# Altium schematic sheet Buck_Boost_Converter_B.SchDoc
size A4; SheetNumber: 8; SheetTotal: 10
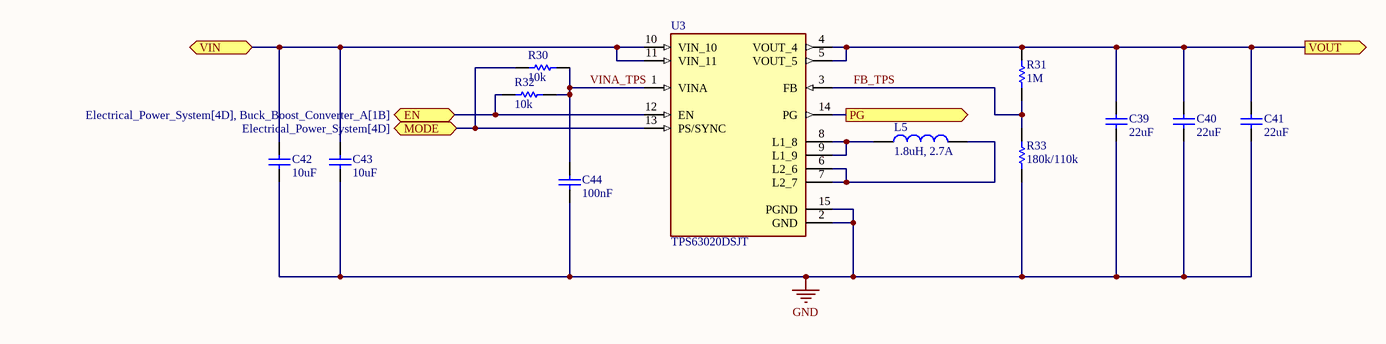
[diagram p0: Buck_Boost_Converter_B.SchDoc]

## Parts
C39  value 22uF  [CAP-SM-0603]  (hidden comment: Cap Non-Pol SMD)
C40  value 22uF  [CAP-SM-0603]  (hidden comment: Cap Non-Pol SMD)
C41  value 22uF  [CAP-SM-0603]  (hidden comment: Cap Non-Pol SMD)
C42  value 10uF  [CAP-SM-0603]  (hidden comment: Cap Non-Pol SMD)
C43  value 10uF  [CAP-SM-0603]  (hidden comment: Cap Non-Pol SMD)
C44  value 100nF  [CAP-SM-0603]  (hidden comment: Cap Non-Pol SMD)
L5  1.8uH, 2.7A  [WE-PD2A_4532]
R30  value 10k  [RES-SM-0603]  (hidden comment: RESISTOR SMD)
R31  value 1M  [RES-SM-0603]  (hidden comment: RESISTOR SMD)
R32  value 10k  [RES-SM-0603]  (hidden comment: RESISTOR SMD)
R33  value 180k/110k  [RES-SM-0603]  (hidden comment: RESISTOR SMD)
U3  TPS63020DSJT  [IC_TPS63020DSJT]

## Ports
EN (bidir, see Electrical_Power_System[4D], Buck_Boost_Converter_A[1B]), MODE (bidir, see Electrical_Power_System[4D]), PG (out, see Electrical_Power_System[4D]), VIN (bidir, see Electrical_Power_System[4D], Buck_Boost_Converter_A[1B]), VOUT (out, see Electrical_Power_System[3D])

## Nets
GND: C39.1 C40.1 C41.1 C42.1 C43.1 C44.1 R33.1 U3.2(GND) U3.15(PGND)
EN: R32.2 U3.12(EN) ; port EN
FB_TPS: R31.1 R33.2 U3.3(FB)
MODE: R30.2 U3.13(PS/SYNC) ; port MODE
PG: U3.14(PG) ; port PG
VIN: C42.2 C43.2 U3.10(VIN_10) U3.11(VIN_11) ; port VIN
VINA_TPS: C44.2 R30.1 R32.1 U3.1(VINA)
VOUT: C39.2 C40.2 C41.2 R31.2 U3.4(VOUT_4) U3.5(VOUT_5) ; port VOUT
NetL5_1: L5.1 U3.8(L1_8) U3.9(L1_9)
NetL5_2: L5.2 U3.6(L2_6) U3.7(L2_7)

## Library data of the parts
C39-C44 = Cap Non-Pol SMD: Capacitor
L5 = 784773018: WE-PD2A SMT Power Inductor, size 4532, 1.8uH, 2.7A; Manufacturer: Wurth Elektronik; DC Resistance max.: 0.064Ohm; Saturation Current: 3.6A; Self Resonant Frequency: 85MHz; DC Resistance typ.: 0.028Ohm; Rated Voltage: 80VDC; ComponentLink1Description: Datasheet; ComponentLink1URL: https://www.we-online.com/catalog/datasheet/784773018.pdf; Manufacturer Part Number: 784773018; Published Date: May 2020; Rated Current: 2.7A; Inductance: 1.8uH; Operating Temperature: -40 to +125degC; Packaging: Tape and Reel; Size: 4532; Supplier 2 URL: https://www.digikey.com/en/products/detail/w%C3%BCrth-elektronik/784773018/5168841?s=N4IgTCBcDaIOwA4Asc4GYAMBGBIC6AvkA; Supplier 1 URL: https://www.mouser.vn/ProductDetail/Wurth-Elektronik/784773018?qs=sBf%2Fb4nBSleQ5H1IVXBHSg%3D%3D; Supplier 3 URL: N/A; Value: 1.8uH, 2.7A; LCSC Part #: N/A; Supplier 1: Mouser; Supplier 1 Part Number: 710-784773018; Supplier 2: Digi-Key; Supplier 2 Part Number: 732-6804-2-ND; Supplier 3: thegioiic; Supplier 3 Part Number: N/A; Mount: SMD/SMT
R30-R33 = RESISTOR SMD: Resistor
U3 = TPS63020DSJT: High Efficiency Single Inductor Buck-Boost Converter with 4A Switch 14-VSON -40 to 85; MF: Texas Instruments; Value: *; SnapEDA_Link: https://www.snapeda.com/parts/TPS63020DSJT/Texas%20Instruments/view-part/225125/?ref=snap; Texas_Instruments-Purchase-URL: https://snapeda.com/shop?store=Texas+Instruments&id=225125; Arrow_Asia-Purchase-URL: https://snapeda.com/shop?store=Arrow+Asia&id=225125; Mouser-Purchase-URL: https://snapeda.com/shop?store=Mouser&id=225125; Availability: Good; Price: None; Package: VSON-14 Texas Instruments; DigiKey-Purchase-URL: https://snapeda.com/shop?store=DigiKey&id=225125; MP: TPS63020DSJT